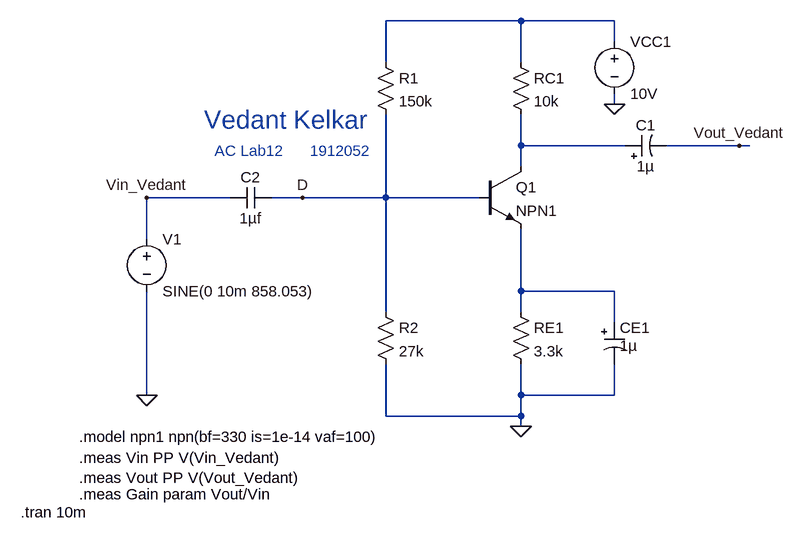
[diagram p0: schematic AC_Lab_122.asc]
AC_Lab_122.asc, the LTspice schematic file:
Version 4
SHEET 1 952 680
WIRE 432 -304 224 -304
WIRE 576 -304 432 -304
WIRE 576 -272 576 -304
WIRE 224 -240 224 -304
WIRE 432 -240 432 -304
WIRE 576 -176 576 -192
WIRE 432 -112 432 -160
WIRE 592 -112 432 -112
WIRE 768 -112 656 -112
WIRE 784 -112 768 -112
WIRE 432 -80 432 -112
WIRE -16 -32 -144 -32
WIRE 96 -32 48 -32
WIRE 224 -32 224 -160
WIRE 224 -32 96 -32
WIRE 368 -32 224 -32
WIRE -144 32 -144 -32
WIRE 432 112 432 16
WIRE 576 112 432 112
WIRE 224 144 224 -32
WIRE 432 144 432 112
WIRE 576 160 576 112
WIRE -144 272 -144 112
WIRE 432 272 432 224
WIRE 576 272 576 224
WIRE 576 272 432 272
WIRE 224 304 224 224
WIRE 432 304 432 272
WIRE 432 304 224 304
WIRE 432 320 432 304
FLAG 768 -112 Vout_Vedant
FLAG 96 -32 D
FLAG 576 -176 0
FLAG 432 320 0
FLAG -144 272 0
FLAG -144 -32 Vin_Vedant
SYMBOL npn 368 -80 R0
SYMATTR InstName Q1
SYMATTR Value NPN1
SYMBOL res 416 -256 R0
SYMATTR InstName RC1
SYMATTR Value 10k
SYMBOL res 208 -256 R0
SYMATTR InstName R1
SYMATTR Value 150k
SYMBOL res 208 128 R0
SYMATTR InstName R2
SYMATTR Value 27k
SYMBOL res 416 128 R0
SYMATTR InstName RE1
SYMATTR Value 3.3k
SYMBOL polcap 592 -96 R270
WINDOW 0 32 32 VTop 2
WINDOW 3 0 32 VBottom 2
SYMATTR InstName C1
SYMATTR Value 1µ
SYMATTR Description Capacitor
SYMATTR Type cap
SYMATTR SpiceLine V=16 Irms=0 Rser=11 Lser=0 mfg="AVX" pn="TAJA105K016" type="Tantalum"
SYMBOL voltage 576 -288 R0
WINDOW 123 0 0 Left 0
WINDOW 39 0 0 Left 0
SYMATTR InstName VCC1
SYMATTR Value 10V
SYMBOL polcap 560 160 R0
WINDOW 3 24 36 Left 2
SYMATTR InstName CE1
SYMATTR Value 1µ
SYMATTR Description Capacitor
SYMATTR Type cap
SYMATTR SpiceLine V=16 Irms=0 Rser=11 Lser=0 mfg="AVX" pn="TAJA105K016" type="Tantalum"
SYMBOL voltage -144 16 R0
WINDOW 123 0 0 Left 0
WINDOW 39 0 0 Left 0
SYMATTR InstName V1
SYMATTR Value SINE(0 10m 858.053)
SYMBOL cap 48 -48 R90
WINDOW 0 0 32 VBottom 2
WINDOW 3 32 32 VTop 2
SYMATTR InstName C2
SYMATTR Value 1µf
TEXT -56 -152 Left 4 ;Vedant Kelkar
TEXT -40 -104 Left 2 ;AC Lab12      1912052
TEXT -248 336 Left 2 !.model npn1 npn(bf=330 is=1e-14 vaf=100)
TEXT -338 452 Left 2 !.tran 10m
TEXT -248 368 Left 2 !.meas Vin PP V(Vin_Vedant)\n.meas Vout PP V(Vout_Vedant)
TEXT -248 424 Left 2 !.meas Gain param Vout/Vin

The netlist it stands for:
* AC_Lab_122.asc
Q1 N002 D N003 0 NPN1
RC1 N001 N002 10k
R1 N001 D 150k
R2 D 0 27k
RE1 N003 0 3.3k
C1 N002 Vout_Vedant 1µ V=16 Irms=0 Rser=11 Lser=0 mfg="AVX" pn="TAJA105K016" type="Tantalum"
VCC1 N001 0 10V
CE1 N003 0 1µ V=16 Irms=0 Rser=11 Lser=0 mfg="AVX" pn="TAJA105K016" type="Tantalum"
V1 Vin_Vedant 0 SINE(0 10m 858.053)
C2 D Vin_Vedant 1µf
.model NPN NPN
.model PNP PNP
.lib standard.bjt
* Vedant Kelkar
* AC Lab12      1912052
.model npn1 npn(bf=330 is=1e-14 vaf=100)
.tran 10m
.meas Vin PP V(Vin_Vedant)
.meas Vout PP V(Vout_Vedant)
.meas Gain param Vout/Vin
.backanno
.end